# Altium project RF_kucuk_kart.PrjPcb
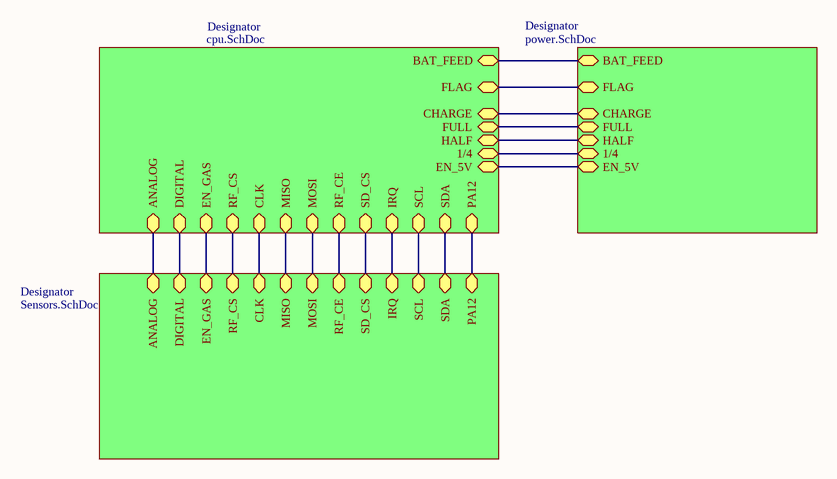
[diagram p0: main sch.SchDoc]
3 sheets, 29 parts. Net scope: hierarchical (ports join the sheet entries above them; power ports are global).
Board file: mainpcb.PcbDoc
Sheets:
  main sch.SchDoc
    Designator = cpu.SchDoc
    Designator = Sensors.SchDoc

## Sheet main sch.SchDoc
size A4

### Sub-sheets
Designator = cpu.SchDoc: RF_CS, CLK, MISO, MOSI, RF_CE, SD_CS, IRQ, SCL, SDA, BAT_FEED, FLAG, PA12, CHARGE, EN_GAS, FULL, HALF, 1/4, ANALOG, DIGITAL, EN_5V
Designator = power.SchDoc (file not in this document): BAT_FEED, FLAG, CHARGE, FULL, HALF, 1/4, EN_5V
Designator = Sensors.SchDoc: IRQ, PA12, MISO, RF_CS, SD_CS, CLK, MOSI, RF_CE, SDA, SCL, EN_GAS, ANALOG, DIGITAL

### Nets
CLK: sheet Designator/CLK, sheet Designator/CLK
IRQ: sheet Designator/IRQ, sheet Designator/IRQ
MISO: sheet Designator/MISO, sheet Designator/MISO
MOSI: sheet Designator/MOSI, sheet Designator/MOSI
RF_CE: sheet Designator/RF_CE, sheet Designator/RF_CE
RF_CS: sheet Designator/RF_CS, sheet Designator/RF_CS
SCL: sheet Designator/SCL, sheet Designator/SCL
SD_CS: sheet Designator/SD_CS, sheet Designator/SD_CS
SDA: sheet Designator/SDA, sheet Designator/SDA
NetQ3_3: sheet Designator/DIGITAL, sheet Designator/DIGITAL
NetR34_1: sheet Designator/ANALOG, sheet Designator/ANALOG
NetR36_2: sheet Designator/EN_GAS, sheet Designator/EN_GAS
NetU1_6: sheet Designator/BAT_FEED, sheet Designator/BAT_FEED
NetU1_8: sheet Designator/EN_5V, sheet Designator/EN_5V
NetU1_14: sheet Designator/FLAG, sheet Designator/FLAG
NetU1_15: sheet Designator/CHARGE, sheet Designator/CHARGE
NetU1_22: sheet Designator/PA12, sheet Designator/PA12
NetU1_26: sheet Designator/FULL, sheet Designator/FULL
NetU1_27: sheet Designator/HALF, sheet Designator/HALF
NetU1_28: sheet Designator/1/4, sheet Designator/1/4

## Sheet cpu.SchDoc
size A4
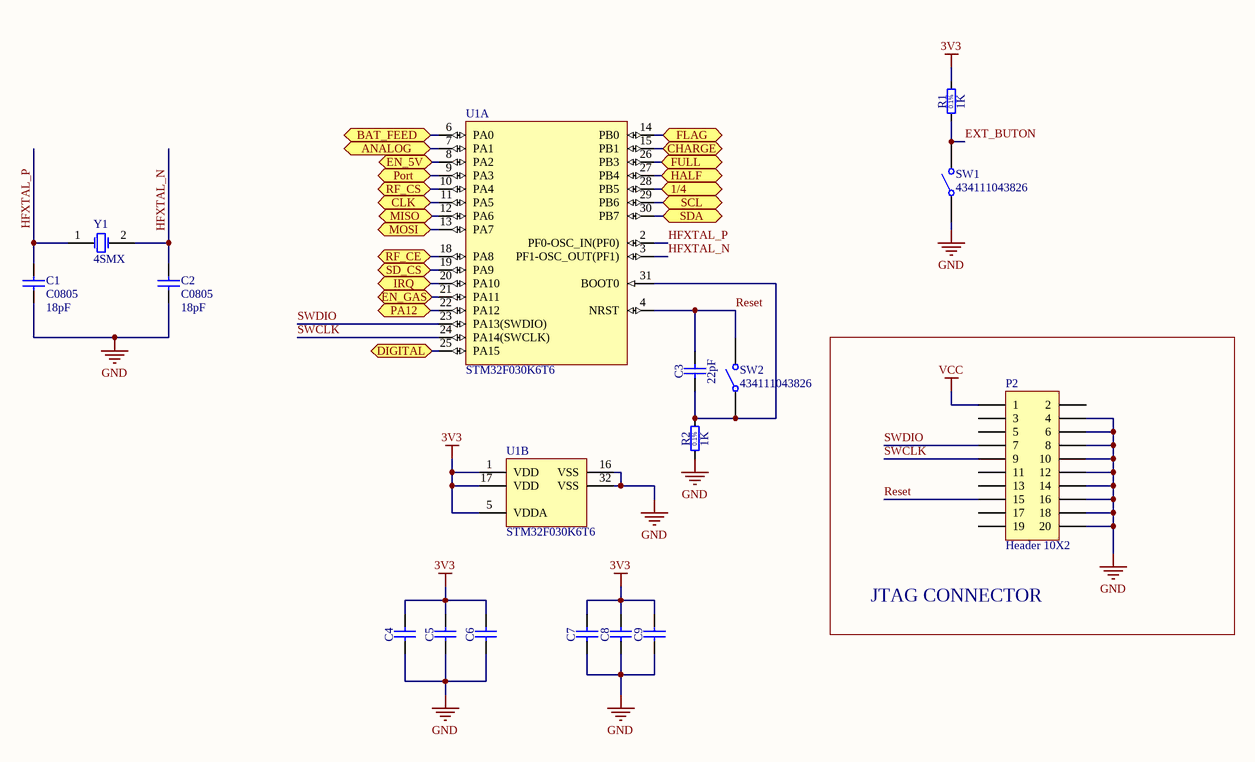
[diagram p1: cpu.SchDoc]

### Parts
C1  C0805  value 18pF  [0805]
C2  C0805  value 18pF  [0805]
C3  22pF  [CAPC2012X135N]
C4  100nF  [CAPC2012X135N]  (value not drawn)
C5  100nF  [CAPC2012X135N]  (value not drawn)
C6  100nF  [CAPC2012X135N]  (value not drawn)
C7  100nF  [CAPC2012X135N]  (value not drawn)
C8  100nF  [CAPC2012X135N]  (value not drawn)
C9  100nF  [CAPC2012X135N]  (value not drawn)
P2  Header 10X2  [HDR2X10]
R1  1K  [RESC2012X60N]
R2  1K  [RESC2012X60N]
SW1  434111043826  [434111043826]
SW2  434111043826  [434111043826]
U1  STM32F030K6T6  [STM-LQFP32_N]  (parts A,B of 2)
Y1  4SMX  [4SMX]

### Blocks framed on the sheet
JTAG CONNECTOR: P2

### Ports
1/4, ANALOG, BAT_FEED, CHARGE, CLK, DIGITAL, EN_5V, EN_GAS, FLAG, FULL, HALF, IRQ, MISO, MOSI, PA12, Port, RF_CE, RF_CS, SCL, SD_CS, SDA

### Nets
3V3: C4.2 C5.2 C6.2 C7.2 C8.2 C9.2 R1.2 U1.1(VDD) U1.5(VDDA) U1.17(VDD)
GND: C1.1 C2.1 C4.1 C5.1 C6.1 C7.1 C8.1 C9.1 P2.4 P2.6 P2.8 P2.10 P2.12 P2.14 P2.16 P2.18 P2.20 R2.1 SW1.1 U1.16(VSS) U1.32(VSS)
VCC: P2.1
CLK: U1.11(PA5) ; port CLK
EXT_BUTON: R1.1 SW1.2
HFXTAL_N: C2.2 U1.3(PF1-OSC_OUT(PF1)) Y1.2(OSC2)
HFXTAL_P: C1.2 U1.2(PF0-OSC_IN(PF0)) Y1.1(OSC1)
IRQ: U1.20(PA10) ; port IRQ
MISO: U1.12(PA6) ; port MISO
MOSI: U1.13(PA7) ; port MOSI
Reset: C3.2 P2.15 SW2.2 U1.4(NRST)
RF_CE: U1.18(PA8) ; port RF_CE
RF_CS: U1.10(PA4) ; port RF_CS
SCL: U1.29(PB6) ; port SCL
SD_CS: U1.19(PA9) ; port SD_CS
SDA: U1.30(PB7) ; port SDA
SWCLK: P2.9 U1.24(PA14(SWCLK))
SWDIO: P2.7 U1.23(PA13(SWDIO))
NetC3_1: C3.1 R2.2 SW2.1 U1.31(BOOT0)
NetQ3_3: U1.25(PA15) ; port DIGITAL
NetR34_1: U1.7(PA1) ; port ANALOG
NetR36_2: U1.21(PA11) ; port EN_GAS
NetU1_6: U1.6(PA0) ; port BAT_FEED
NetU1_8: U1.8(PA2) ; port EN_5V
NetU1_9: U1.9(PA3) ; port Port
NetU1_14: U1.14(PB0) ; port FLAG
NetU1_15: U1.15(PB1) ; port CHARGE
NetU1_22: U1.22(PA12) ; port PA12
NetU1_26: U1.26(PB3) ; port FULL
NetU1_27: U1.27(PB4) ; port HALF
NetU1_28: U1.28(PB5) ; port 1/4

Not connected (* = marked no-connect by the designer): P2 2 3 5 11 13 17 19

### Notes on the sheet
- (in symbol R0805_1K1_0.1%_0.1W_10PPM) 0.1%

### Library data of the parts
C1 C2 = C0805: Ceramic Chip Capacitor - Standard; Note: Footprint corresponds to dimensions for bulk cassette packaging. This case size has tightened tolerances.; Published: 17-Jul-2002; LatestRevisionDate: 19-Mar-2004; LatestRevisionNote: Silkscreen size reduced.; DatasheetDocument: Mar-2001; PackageDocument: Mar-2001; PackageReference: 0805; Publisher: Altium Limited; Code_JEITA: 0805; Code_IPC: 2012[0805]; ComponentLink1Description: Manufacturer Link; ComponentLink1URL: http://www.kemet.com/; ComponentLink2Description: Datasheet; ComponentLink2URL: http://www.kemet.com/kemet/web/homepage/kechome.nsf/vapubfilesname/F3102TA.pdf/$file/F3102TA.pdf
C3 = CC0805_10NF_50V_10%_X7R: Non-polarised capacitor; Part Description: SMD Multilayer Chip Ceramic Capacitor; Manufacturer: GENERIC; Manufacturer1 Part Number: B37941K5103K60; Voltage: 50V; TC: X7R; Tolerance: ±10%; Table: Capacitors SMD; Part Number: CC0805_10NF_50V_10%_X7R; Component Kind: Standard; Component Type: Standard; Pin Count: 2; Value: 22pF; Status: Preferred; Manufacturer Part Number: CC0805_10NF_50V_10%_X7R; Case: 0805; Mounted: Yes; Socket: No; SMD: Yes; Manufacturer1 Example: EPCOS; Manufacturer1 ComponentHeight: 1.35mm; HelpURL: \\cern.ch\dfs\Applications\Altium\Datasheets\CC0805_X7R_EPCOS.pdf; Author: CERN DEM JLC; CreateDate: 03.12.2007; LatestRevisionDate: 03.12.2007
C4-C9 = CC0805_1NF_50V_5%_X7R: Non-polarised capacitor; Part Description: SMD Multilayer Chip Ceramic Capacitor; Manufacturer: GENERIC; Manufacturer1 Part Number: 08055C102JAT2A; Voltage: 50V; TC: X7R; Tolerance: ±5%; Table: Capacitors SMD; Part Number: CC0805_1NF_50V_5%_X7R; Component Kind: Standard; Component Type: Standard; Pin Count: 2; Value: 100nF; Status: None; Manufacturer Part Number: CC0805_1NF_50V_5%_X7R; Case: 0805; Mounted: Yes; Socket: No; SMD: Yes; Manufacturer1 Example: AVX; Manufacturer1 ComponentHeight: 0.94mm; HelpURL: \\cern.ch\dfs\Applications\Altium\Datasheets\CC0805_X7R_AVX.pdf; Author: CERN DEM JLC; CreateDate: 18.01.2011; LatestRevisionDate: 18.01.2011
P2 = Header 10X2: Header, 10-Pin, Dual row; LatestRevisionDate: 17-Jul-2002; LatestRevisionNote: Re-released for DXP Platform.; Publisher: Altium Limited
R1 R2 = R0805_1K1_0.1%_0.1W_10PPM: Resistor - 0.1%; Part Description: Thin Film Chip Resistor; Manufacturer: GENERIC; Manufacturer1 Part Number: RN73C2A1K1BTG; Power: 0.1W; TC: ±10ppm; Table: Resistors SMD; Part Number: R0805_1K1_0.1%_0.1W_10PPM; Component Kind: Standard; Component Type: Standard; Pin Count: 2; Value: 1K; Status: Not recommended; Tolerance: ±0.1%; Manufacturer Part Number: R0805_1K1_0.1%_0.1W_10PPM; Case: 0805; Mounted: Yes; Socket: No; SMD: Yes; Manufacturer1 Example: TYCO HOLSWORTHY; Manufacturer1 ComponentHeight: 0.6mm; HelpURL: \\cern.ch\dfs\Applications\Altium\Datasheets\R0805_Tyco_RN73.pdf; Author: CERN DEM JLC; CreateDate: 03.12.2007; LatestRevisionDate: 13.03.2008
SW1 SW2 = 434111043826: WS-TASV SMD Tact Switch 6.0X3.5 mm; NoPins: 02; PackageReference: 434111043826; PartNumber: 434111043826; ComponentLink1Description: Manufacturer URL; ComponentLink1URL: http://www.we-online.com; ComponentLink2Description: Datasheet; ComponentLink2URL: http://katalog.we-online.de/em/datasheet/434111043826.pdf
U1 = STM32F030K6T6: ARM Cortex-M0 32-bit MCU, 32 KB Flash, 4 KB Internal RAM, 26 I/Os, 32-pin LQFP, -40 to 85 degC, Tray; FLASH Size (Prog) (kB): 32; I/Os (High Current): 26; Internal RAM Size (kB): 4; Operating Frequency(F) (Processor speed) (MHz): 48; Supply Voltage(Vcc) min (V): 2.4; DatasheetVersion: Rev. 1; PackageVersion: Rev. 1, 07/2013; PackageReference: LQFP32; PackageDescription: 32-Pin Low Profile Quad Flat Package, 7 x 7 mm Body, 0.8 mm Pitch; Supplier 1: Digi-Key; Supplier Part Number 1: 497-14046-ND; Supplier 2: Newark; Supplier Part Number 2: 19X6194; Supplier 3: Mouser; Supplier Part Number 3: 511-STM32F030K6T6; Core: ARM Cortex-M0; Packing: Tray; Mounting Technology: Surface Mount; PartNumber: STM32F030K6T6; ComponentLink1Description: Manufacturer URL; ComponentLink1URL: http://www.st.com/web/en/home.html; ComponentLink2Description: Datasheet; ComponentLink2URL: http://www.st.com/st-web-ui/static/active/en/resource/technical/document/datasheet/DM00088500.pdf; ComponentLink3Description: Package Specification; ComponentLink3URL: http://www.st.com/st-web-ui/static/active/en/resource/technical/document/datasheet/DM00088500.pdf
Y1 = 4SMX: Surface Mount Quartz Crystal; Note: PCB layout complies with manufacturer's recommendation.; Published: 17-Jul-2002; DatasheetDocument: 9-Sep-1999; PackageDocument: 9-Sep-1999; PackageReference: 4SMX; Publisher: Altium Limited; ComponentLink1Description: Manufacturer Link; ComponentLink1URL: http://www.cmac.com/mt/

## Sheet Sensors.SchDoc
size A4
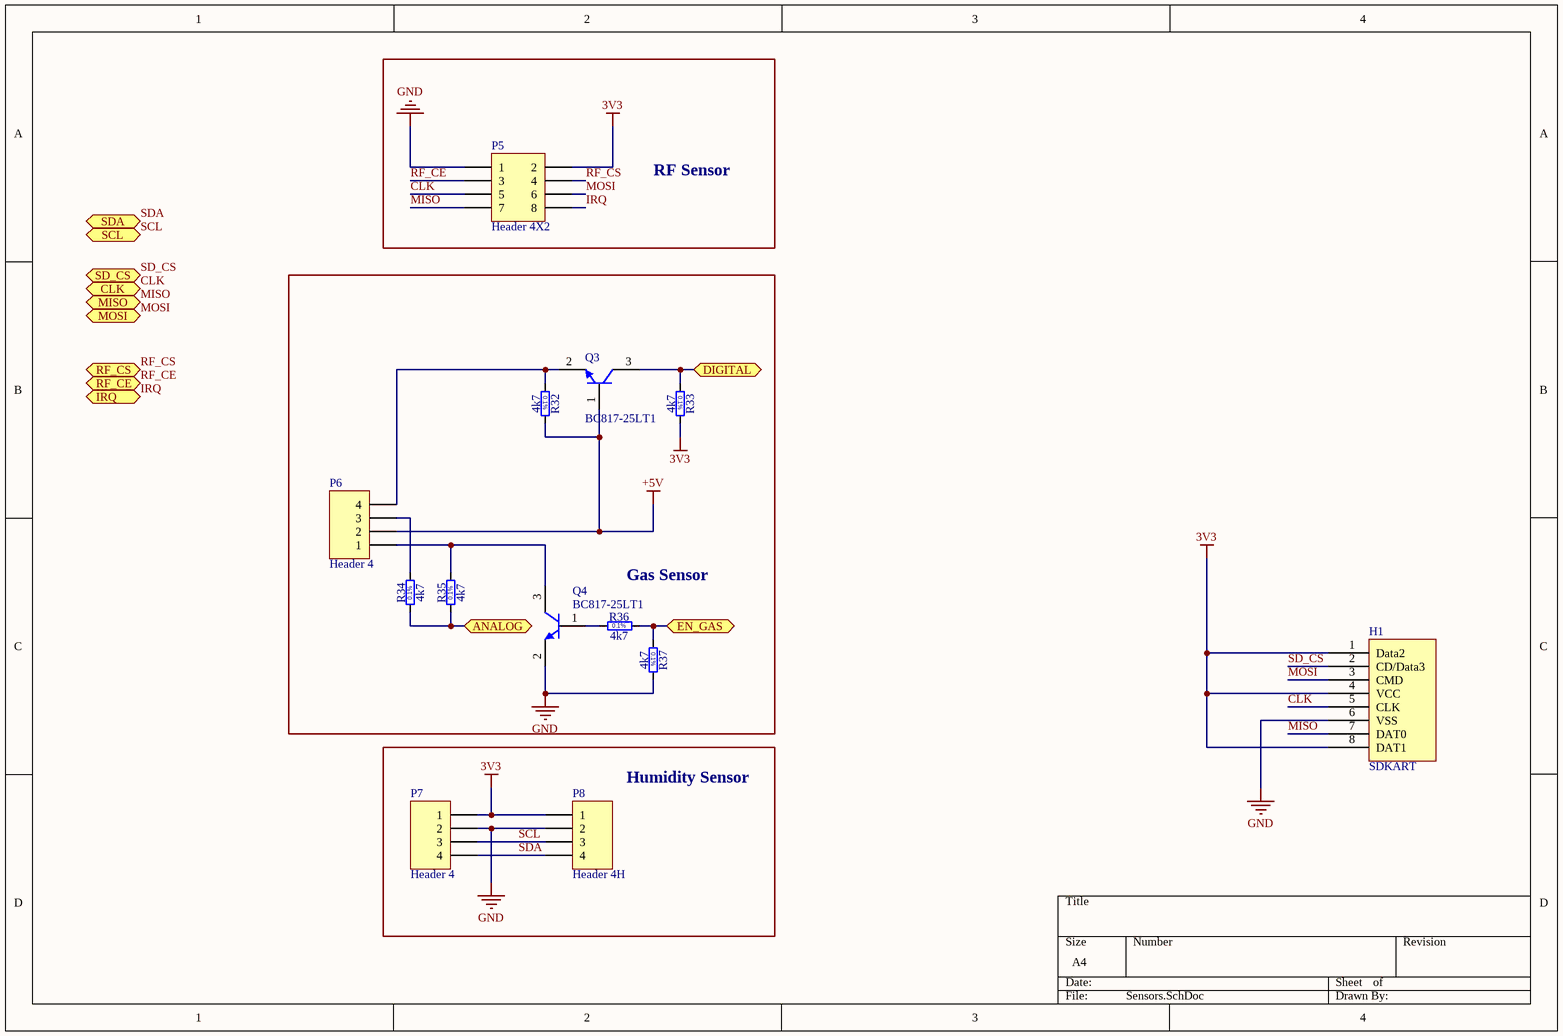
[diagram p2: Sensors.SchDoc]

### Parts
H1  SDKART  [PCBComponent_1]
P5  Header 4X2  [HDR2X4]
P6  Header 4  [HDR1X4]
P7  Header 4  [HDR1X4]
P8  Header 4H  [HDR1X4H]
Q3  BC817-25LT1  [ONSC-SOT-23-3-318-08_V]
Q4  BC817-25LT1  [ONSC-SOT-23-3-318-08_V]
R32  4k7  [RESC2012X60N]
R33  4k7  [RESC2012X60N]
R34  4k7  [RESC2012X60N]
R35  4k7  [RESC2012X60N]
R36  4k7  [RESC2012X60N]
R37  4k7  [RESC2012X60N]

### Blocks framed on the sheet
RF Sensor: P5
Gas Sensor: P6 Q3 Q4 R32-R37
Humidity Sensor: P7 P8

### Ports
ANALOG, CLK, DIGITAL, EN_GAS, IRQ, MISO, MOSI, RF_CE, RF_CS, SCL, SD_CS, SDA

### Nets
3V3: H1.1(Data2) H1.4(VCC) H1.8(DAT1) P5.2 P7.1 P8.1 R33.2
+5V: P6.2 Q3.1(B) R32.2
GND: H1.6(VSS) P5.1 P7.2 P8.2 Q4.2(E) R37.2
CLK: H1.5(CLK) P5.5 ; port CLK
IRQ: P5.8 ; port IRQ
MISO: H1.7(DAT0) P5.7 ; port MISO
MOSI: H1.3(CMD) P5.6 ; port MOSI
RF_CE: P5.3 ; port RF_CE
RF_CS: P5.4 ; port RF_CS
SCL: P7.3 P8.3 ; port SCL
SD_CS: H1.2(CD/Data3) ; port SD_CS
SDA: P7.4 P8.4 ; port SDA
NetP6_1: P6.1 Q4.3(C) R35.2
NetP6_3: P6.3 R34.2
NetP6_4: P6.4 Q3.2(E) R32.1
NetQ3_3: Q3.3(C) R33.1 ; port DIGITAL
NetQ4_1: Q4.1(B) R36.1
NetR34_1: R34.1 R35.1 ; port ANALOG
NetR36_2: R36.2 R37.1 ; port EN_GAS

### Notes on the sheet
- (in symbol R0805_1K1_0.1%_0.1W_10PPM) 0.1%

### Library data of the parts
P5 = Header 4X2: Header, 4-Pin, Dual row; LatestRevisionDate: 17-Jul-2002; LatestRevisionNote: Re-released for DXP Platform.; Publisher: Altium Limited
P6 P7 = Header 4: Header, 4-Pin; LatestRevisionDate: 17-Jul-2002; LatestRevisionNote: Re-released for DXP Platform.; Publisher: Altium Limited
P8 = Header 4H: Header, 4-Pin, Right Angle; LatestRevisionDate: 17-Jul-2002; LatestRevisionNote: Re-released for DXP Platform.; Publisher: Altium Limited
Q3 Q4 = BC817-25LT1: General Purpose Transistor, NPN Silicon, 3-Pin SOT-23, Tape and Reel; Manufacturer: On Semiconductor; fT Min (MHz): 100; IC Continuous (A): 0.5; DatasheetVersion: Rev. 12; PackageVersion: Rev. AP, 11/2009; PackageReference: SOT-23-3-318-08; PackageDescription: 3-Pin Small Outline Transistor, Body 2.92 x 1.3 mm, Pitch 0.95 mm; Supplier 1: Digi-Key; Supplier Part Number 1: BC817-25LT1OSCT-ND; Packing: Tape and Reel; Polarity: NPN; RoHS: FALSE; Mounting Technology: Surface Mount; PartNumber: BC817-25LT1; ComponentLink1Description: Manufacturer URL; ComponentLink1URL: http://www.onsemi.com/; ComponentLink2Description: Datasheet; ComponentLink2URL: http://www.onsemi.com/pub_link/Collateral/BC817-16LT1-D.PDF; ComponentLink3Description: Package Specification; ComponentLink3URL: http://www.onsemi.cn/pub_link/Collateral/318-08.PDF
R32-R37 = R0805_1K1_0.1%_0.1W_10PPM: as R1 on sheet cpu; Part Number: R0805_1K1_0.1%_0.1W_10PPM; Component Kind: Standard; Component Type: Standard; Pin Count: 2; Value: 4k7; Status: Not recommended; Tolerance: ±0.1%; Manufacturer Part Number: R0805_1K1_0.1%_0.1W_10PPM; Case: 0805; Mounted: Yes; Socket: No; SMD: Yes; Manufacturer1 Example: TYCO HOLSWORTHY; Manufacturer1 ComponentHeight: 0.6mm; HelpURL: \\cern.ch\dfs\Applications\Altium\Datasheets\R0805_Tyco_RN73.pdf; Author: CERN DEM JLC; CreateDate: 03.12.2007; LatestRevisionDate: 13.03.2008

## Nets that join several sheets
3V3: cpu (10 pins), Sensors (7 pins)
GND: cpu (21 pins), Sensors (6 pins)
CLK: cpu (U1.11), Sensors (H1.5 P5.5)
IRQ: cpu (U1.20), Sensors (P5.8)
MISO: cpu (U1.12), Sensors (H1.7 P5.7)
MOSI: cpu (U1.13), Sensors (H1.3 P5.6)
NetQ3_3: cpu (U1.25), Sensors (Q3.3 R33.1)
NetR34_1: cpu (U1.7), Sensors (R34.1 R35.1)
NetR36_2: cpu (U1.21), Sensors (R36.2 R37.1)
RF_CE: cpu (U1.18), Sensors (P5.3)
RF_CS: cpu (U1.10), Sensors (P5.4)
SCL: cpu (U1.29), Sensors (P7.3 P8.3)
SD_CS: cpu (U1.19), Sensors (H1.2)
SDA: cpu (U1.30), Sensors (P7.4 P8.4)